# Altium schematic sheet main.SchDoc
size A3
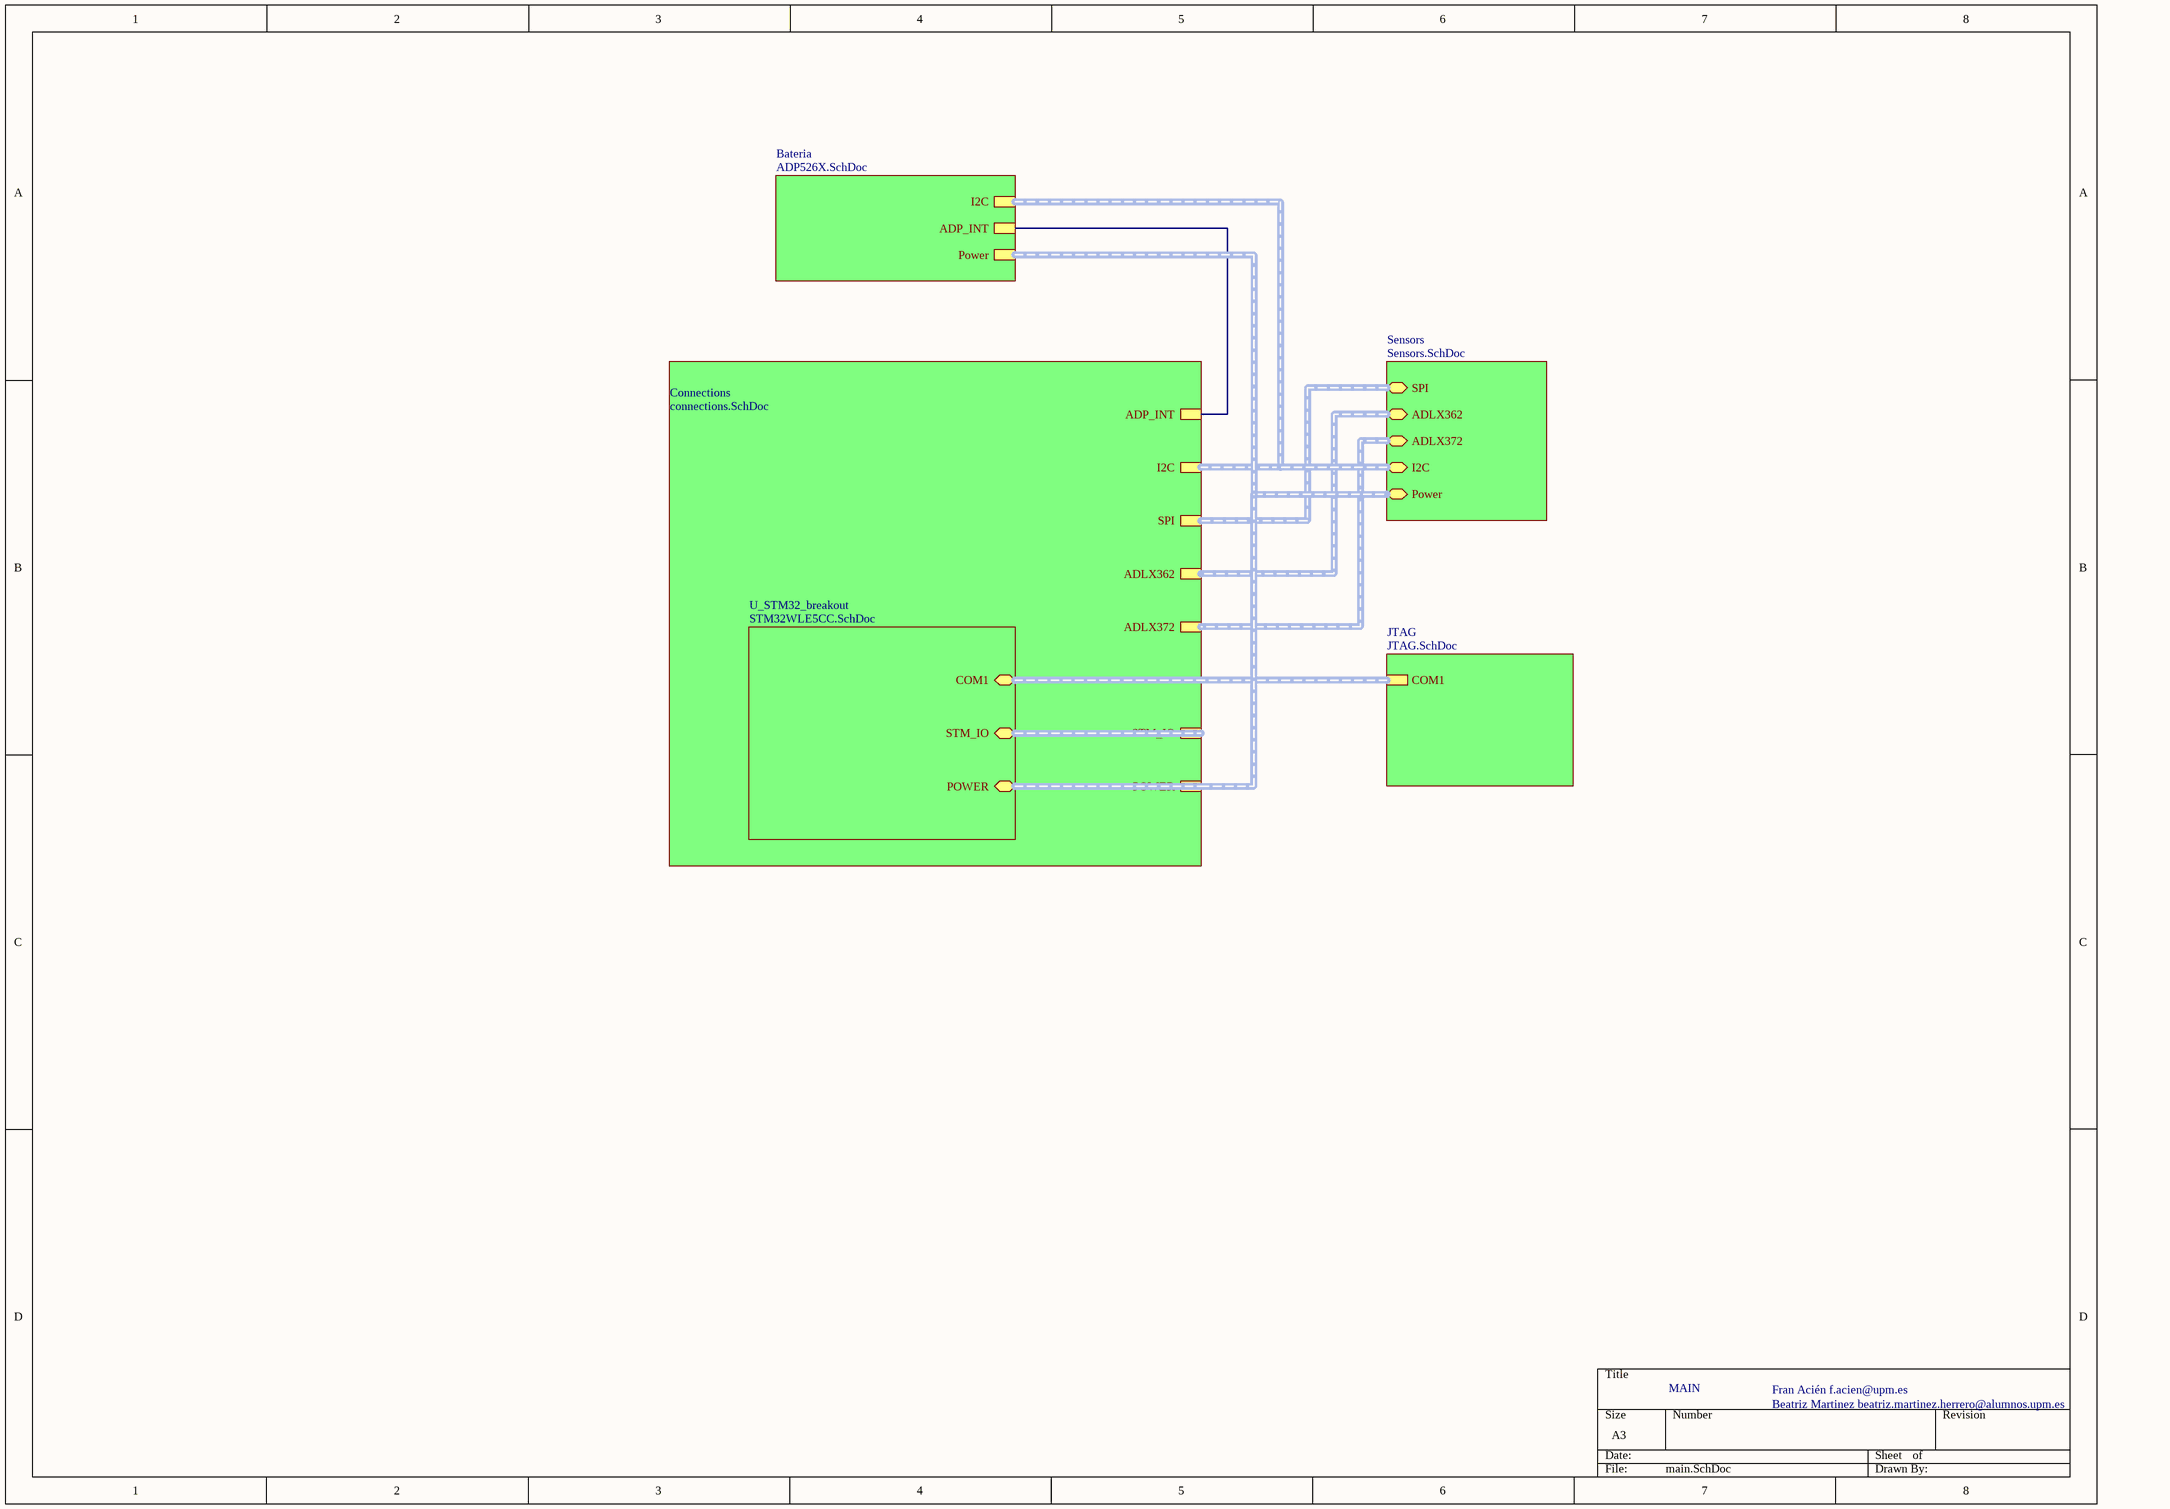
[diagram p0: main.SchDoc]

## Sub-sheets
Bateria = ADP526X.SchDoc: I2C (harness I2C), Power (harness Power), ADP_INT
Connections = connections.SchDoc: I2C (harness I2C), SPI (harness SPI), ADLX362 (harness ADLX362), ADLX372 (harness ADLX372), STM_IO, POWER (harness Power), ADP_INT
JTAG = JTAG.SchDoc: COM1 (harness SWD)
Sensors = Sensors.SchDoc: SPI (bidir, harness SPI), ADLX362 (bidir, harness ADLX362), ADLX372 (bidir, harness ADLX372), I2C (bidir, harness BME680), Power (bidir, harness Power)
U_STM32_breakout = STM32WLE5CC.SchDoc: STM_IO (bidir, harness IO), COM1 (bidir, harness SWD), POWER (bidir, harness Power)

## Nets
(unnamed): sheet Connections/ADP_INT, sheet Bateria/ADP_INT

## Buses and harness runs
harness sheet Bateria/I2C = sheet Connections/I2C = sheet Sensors/I2C
harness sheet Bateria/Power = sheet Connections/POWER = sheet Sensors/Power = sheet U_STM32_breakout/POWER
harness sheet Connections/ADLX362 = sheet Sensors/ADLX362
harness sheet Connections/ADLX372 = sheet Sensors/ADLX372
harness sheet Connections/SPI = sheet Sensors/SPI
harness sheet Connections/STM_IO = sheet U_STM32_breakout/STM_IO
harness sheet JTAG/COM1 = sheet U_STM32_breakout/COM1

## Notes on the sheet
- MAIN
- Fran Acién f.acien@upm.es
- Beatriz Martinez beatriz.martinez.herrero@alumnos.upm.es